# Altium schematic sheet Project_Overviev.SchDoc
size A4; SheetNumber: 1; SheetTotal: 5
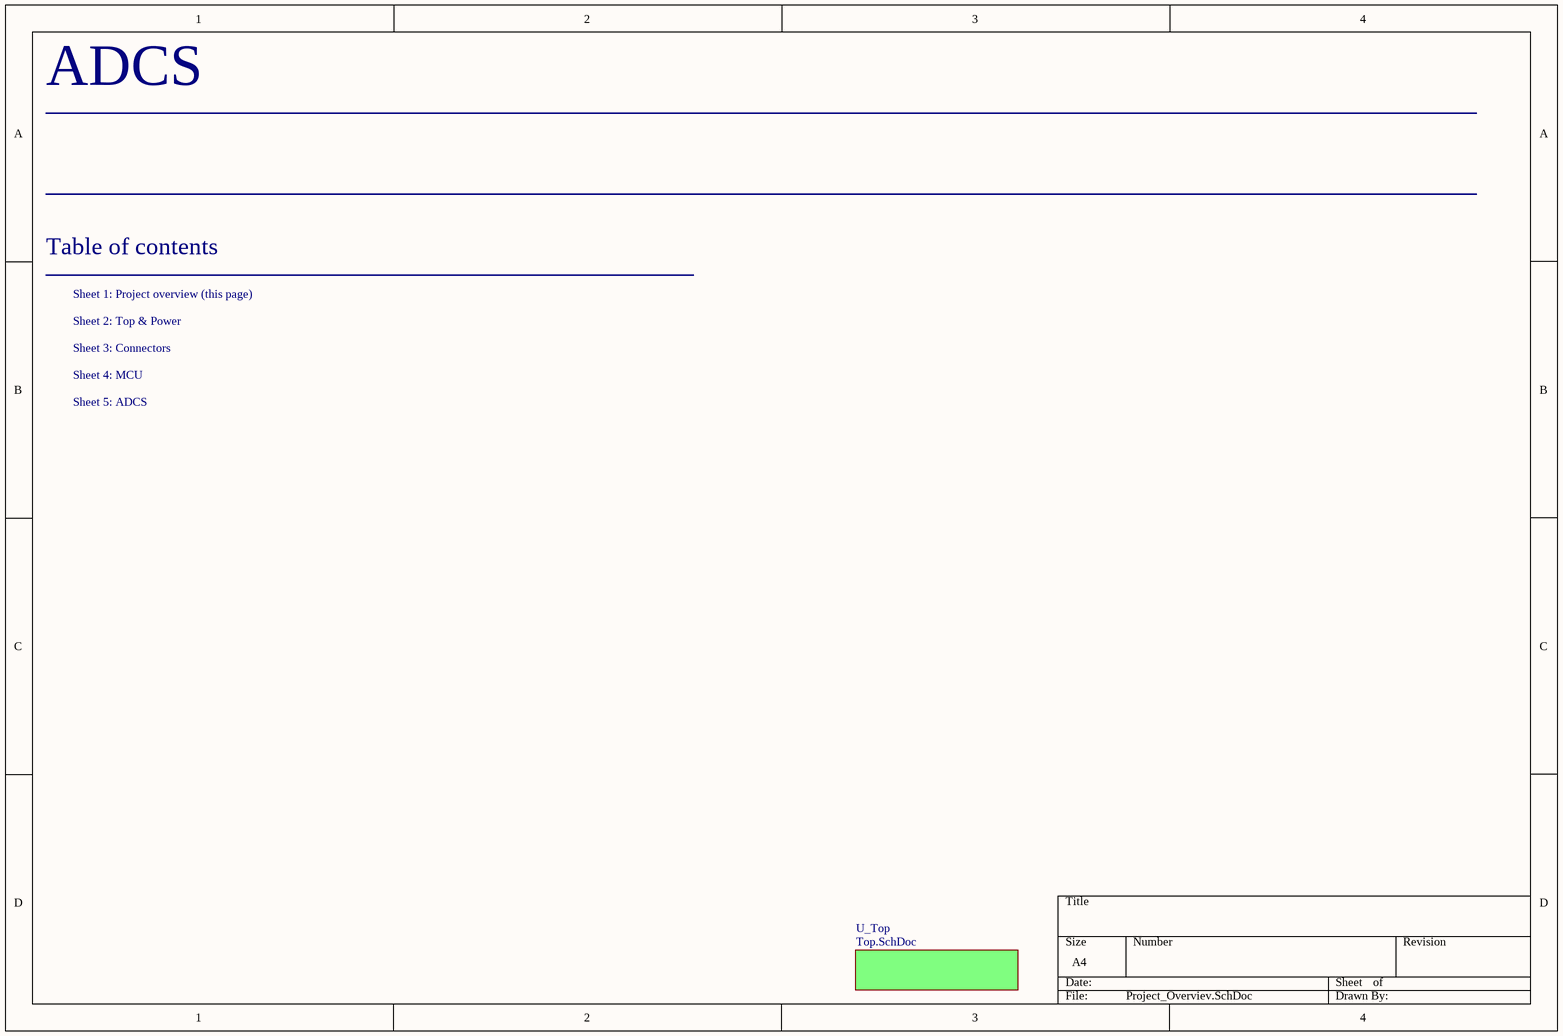
[diagram p0: Project_Overviev.SchDoc]

## Sub-sheets
U_Top = Top.SchDoc: no entries

## Notes on the sheet
- ADCS
- Table of contents
- Sheet 1: Project overview (this page)
- Sheet 2: Top & Power
- Sheet 3: Connectors
- Sheet 4: MCU
- Sheet 5: ADCS